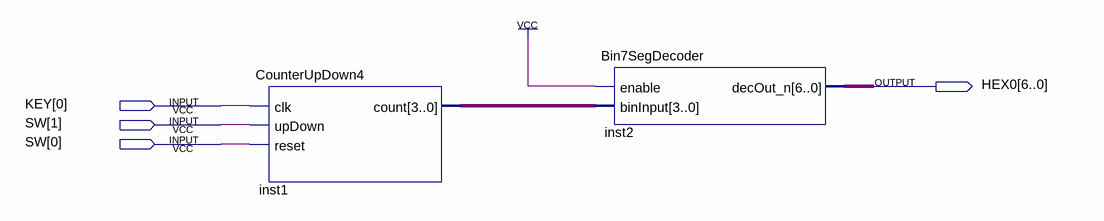
[diagram p0: schematic sheet]
// Quartus schematic Counter_Demo.bdf as structural Verilog: 2 symbols, 4 pins
module Counter_Demo (
  input  [0:0] KEY,
  input  [1:0] SW,
  output [6:0] HEX0
);

  wire [3:0] inst1_count;

  CounterUpDown4 inst1 (.clk(KEY[0]), .upDown(SW[1]), .reset(SW[0]), .count(inst1_count));
  Bin7SegDecoder inst2 (.enable(1'b1), .binInput(inst1_count), .decOut_n(HEX0));
endmodule
